# EAGLE design Nappe2.0 _ Pannelized_3 (EAGLE 9.6.2)
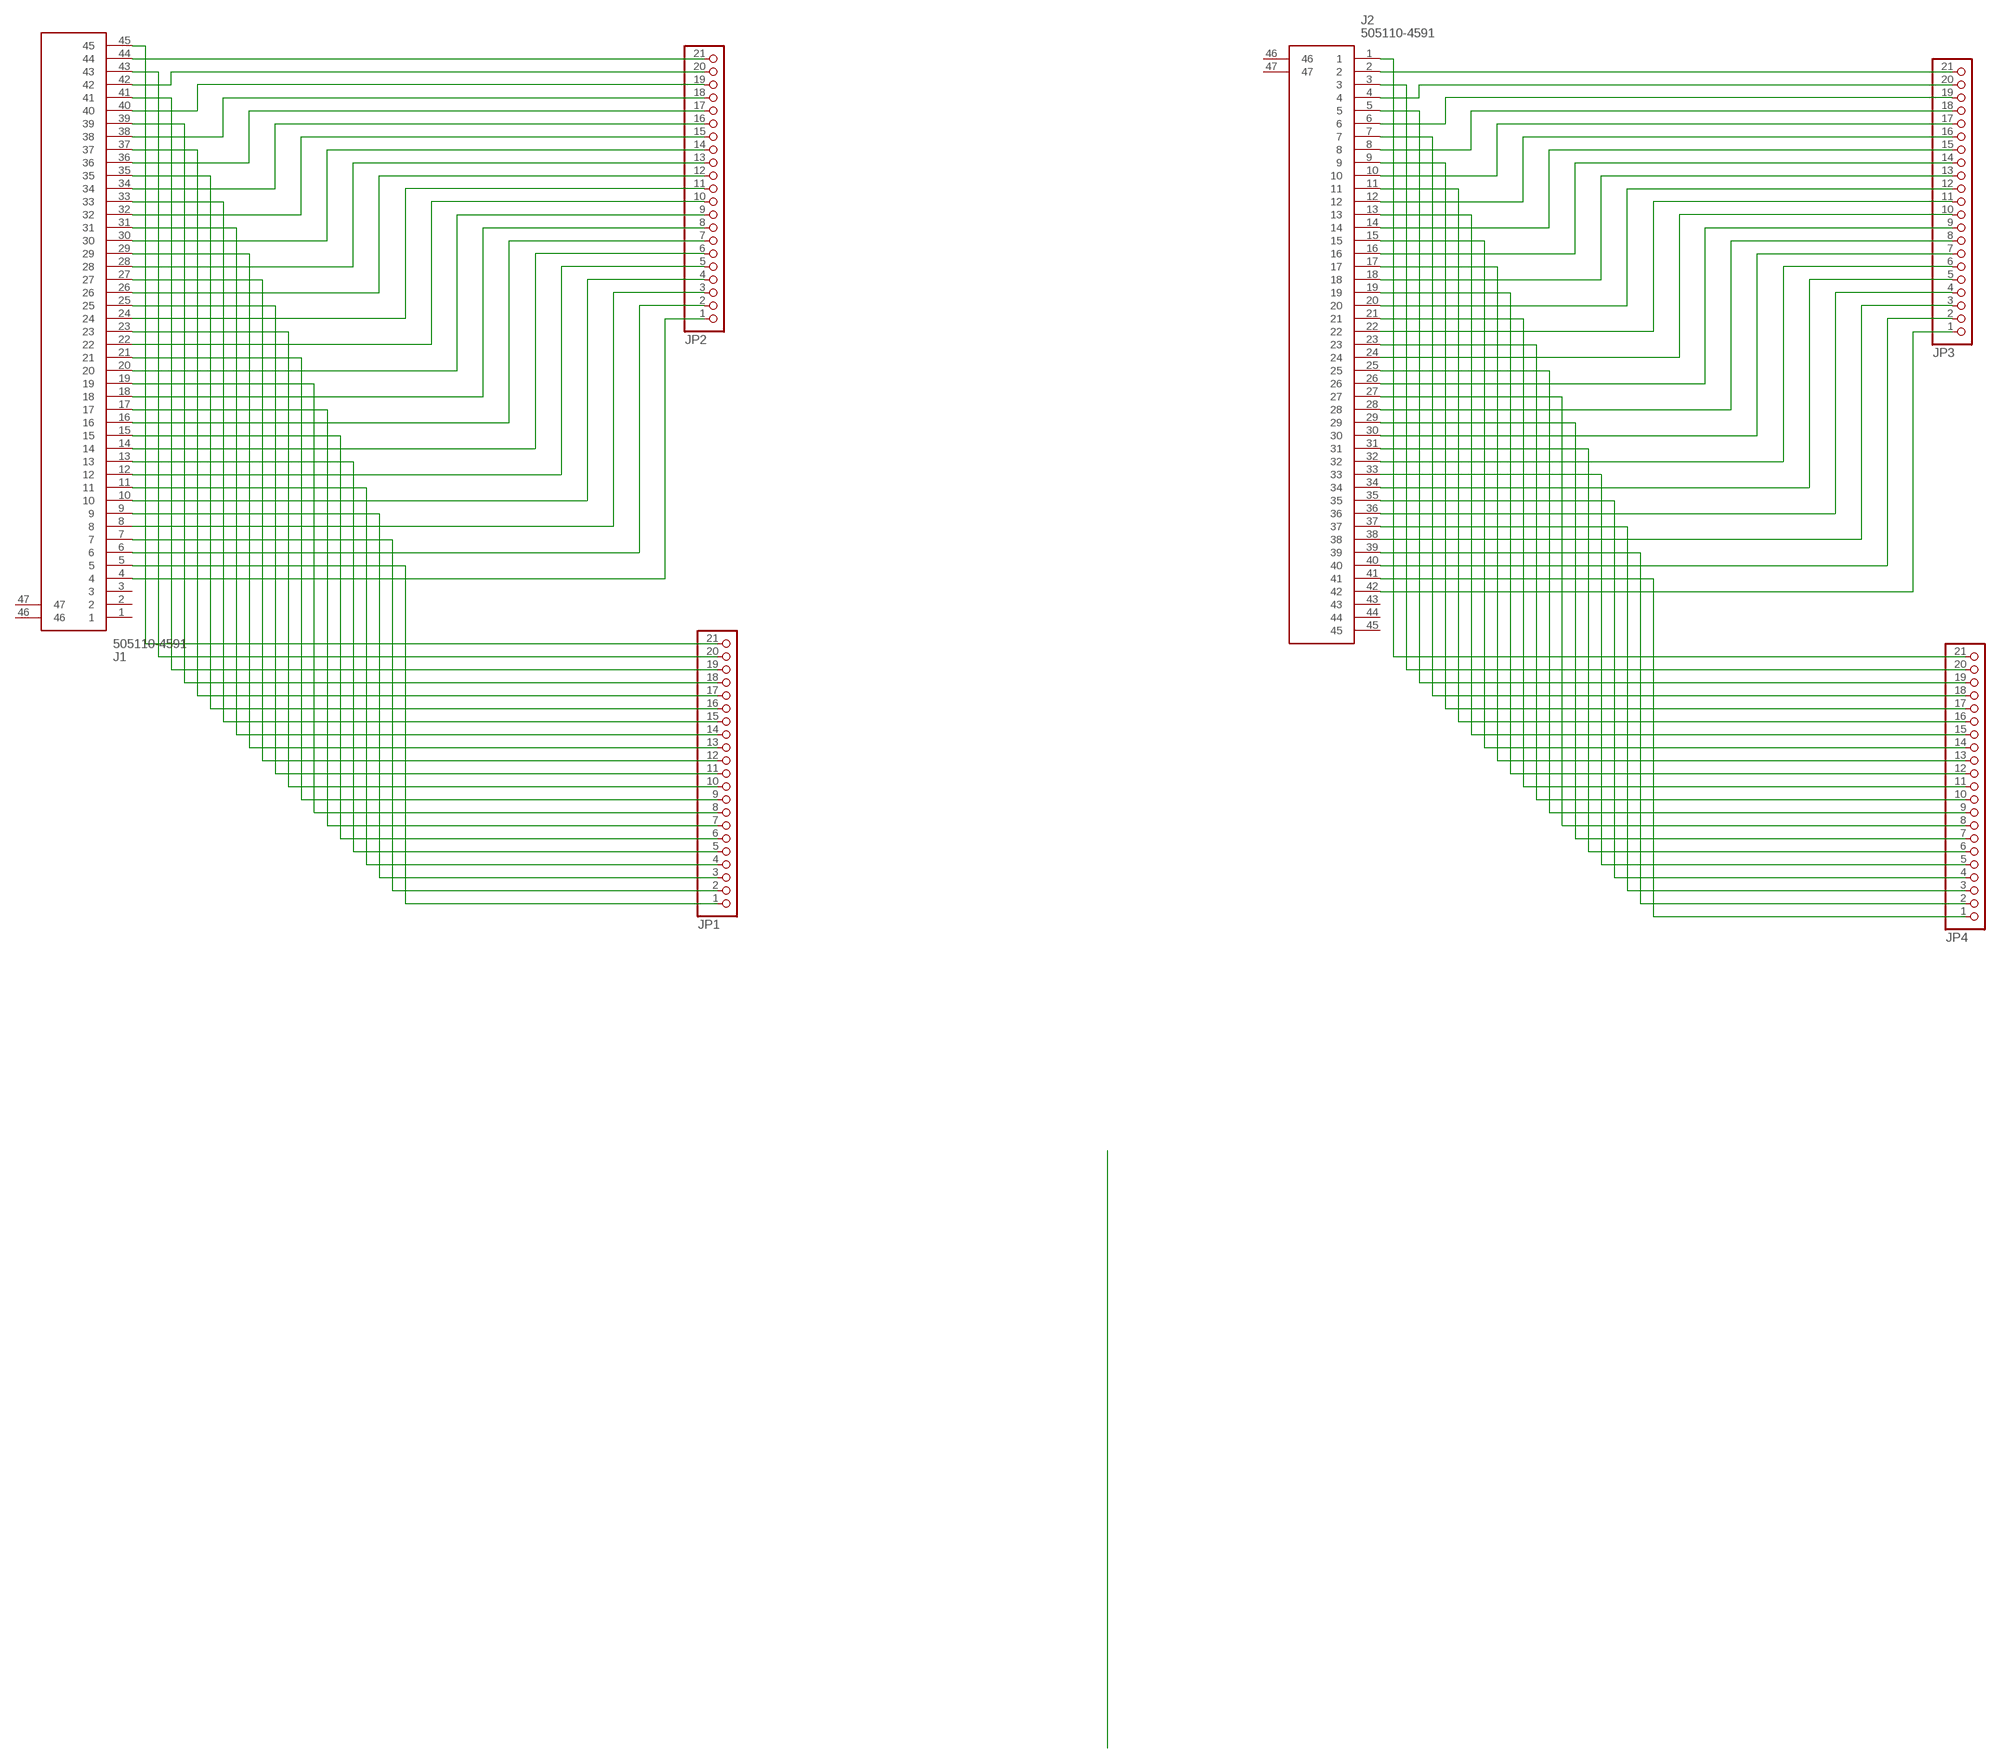
[diagram p0: schematic, sheet 1]

## Parts
J1  505110-4591  [5051104591]
J2  505110-4591  [5051104591]
JP1  PINHD-1X21(2.4)  [1X21(2.4)]
JP2  PINHD-1X21(2.4)  [1X21(2.4)]
JP3  PINHD-1X21(2.4)  [1X21(2.4)]
JP4  PINHD-1X21(2.4)  [1X21(2.4)]

## Nets
N$1: J2.2 JP3.21
N$6: J2.3 JP4.20
N$9: J2.26 JP3.9
N$10: J2.4 JP3.20
N$13: J2.6 JP3.19
N$14: J2.28 JP3.8
N$15: J2.18 JP3.13
N$16: J2.8 JP3.18
N$17: J2.10 JP3.17
N$19: J2.12 JP3.16
N$22: J2.14 JP3.15
N$23: J2.16 JP3.14
N$24: J2.20 JP3.12
N$25: J2.22 JP3.11
N$26: J2.24 JP3.10
N$27: J2.30 JP3.7
N$28: J2.32 JP3.6
N$29: J2.34 JP3.5
N$30: J2.36 JP3.4
N$31: J2.42 JP3.1
N$32: J2.40 JP3.2
N$33: J2.38 JP3.3
N$34: J2.1 JP4.21
N$35: J2.5 JP4.19
N$36: J2.7 JP4.18
N$37: J2.9 JP4.17
N$38: J2.11 JP4.16
N$39: J2.13 JP4.15
N$40: J2.15 JP4.14
N$41: J2.17 JP4.13
N$42: J2.41 JP4.1
N$43: J1.44 JP2.21
N$44: J1.42 JP2.20
N$45: J1.40 JP2.19
N$46: J2.27 JP4.8
N$47: J1.38 JP2.18
N$48: J1.36 JP2.17
N$49: J2.33 JP4.5
N$50: J1.34 JP2.16
N$51: J1.32 JP2.15
N$52: J2.21 JP4.11
N$53: J2.23 JP4.10
N$54: J2.25 JP4.9
N$55: J1.30 JP2.14
N$56: J2.29 JP4.7
N$57: J2.31 JP4.6
N$59: J2.39 JP4.2
N$60: J2.37 JP4.3
N$61: J2.35 JP4.4
N$62: J2.19 JP4.12
N$63: J1.28 JP2.13
N$64: J1.26 JP2.12
N$65: J1.24 JP2.11
N$66: J1.22 JP2.10
N$67: J1.20 JP2.9
N$68: J1.18 JP2.8
N$69: J1.16 JP2.7
N$70: J1.14 JP2.6
N$71: J1.12 JP2.5
N$72: J1.10 JP2.4
N$73: J1.6 JP2.2
N$74: J1.8 JP2.3
N$75: J1.4 JP2.1
N$77: J1.45 JP1.21
N$78: J1.43 JP1.20
N$79: J1.41 JP1.19
N$80: J1.39 JP1.18
N$81: J1.37 JP1.17
N$82: J1.35 JP1.16
N$83: J1.33 JP1.15
N$84: J1.31 JP1.14
N$85: J1.29 JP1.13
N$86: J1.19 JP1.8
N$88: J1.25 JP1.11
N$89: J1.23 JP1.10
N$90: J1.21 JP1.9
N$91: J1.17 JP1.7
N$92: J1.15 JP1.6
N$93: J1.13 JP1.5
N$96: J1.7 JP1.2
N$98: J1.9 JP1.3
N$99: J1.11 JP1.4
N$100: J1.27 JP1.12
N$101: J1.5 JP1.1
Unconnected: J1.1 J1.2 J1.3 J1.46 J1.47 J2.43 J2.44 J2.45 J2.46 J2.47

## Library data of the parts
J1 J2 = Molex - 505110-4591:505110-4591: MOLEX - 505110-4591 - CONNECTOR, FFC/FPC, 45POS, 1ROW, 0.5MM Source: Datasheet <https://www.molex.com/pdm_docs/sd/5051104591_sd.pdf>; DESCRIPTION: MOLEX - 505110-4591 - CONNECTOR, FFC/FPC, 45POS, 1ROW, 0.5MM; HEIGHT: 2.1mm; MANUFACTURER_NAME: Molex; MANUFACTURER_PART_NUMBER: 505110-4591; MOUSER_PART_NUMBER: 538-505110-4591; MOUSER_PRICE-STOCK: https://www.mouser.co.uk/ProductDetail/Molex/505110-4591?qs=fSIr1QPo%2F%2FReZXIaVbuxKA%3D%3D
JP1-JP4 = pinhead:PINHD-1X21(2.4): PIN HEADER

## Board
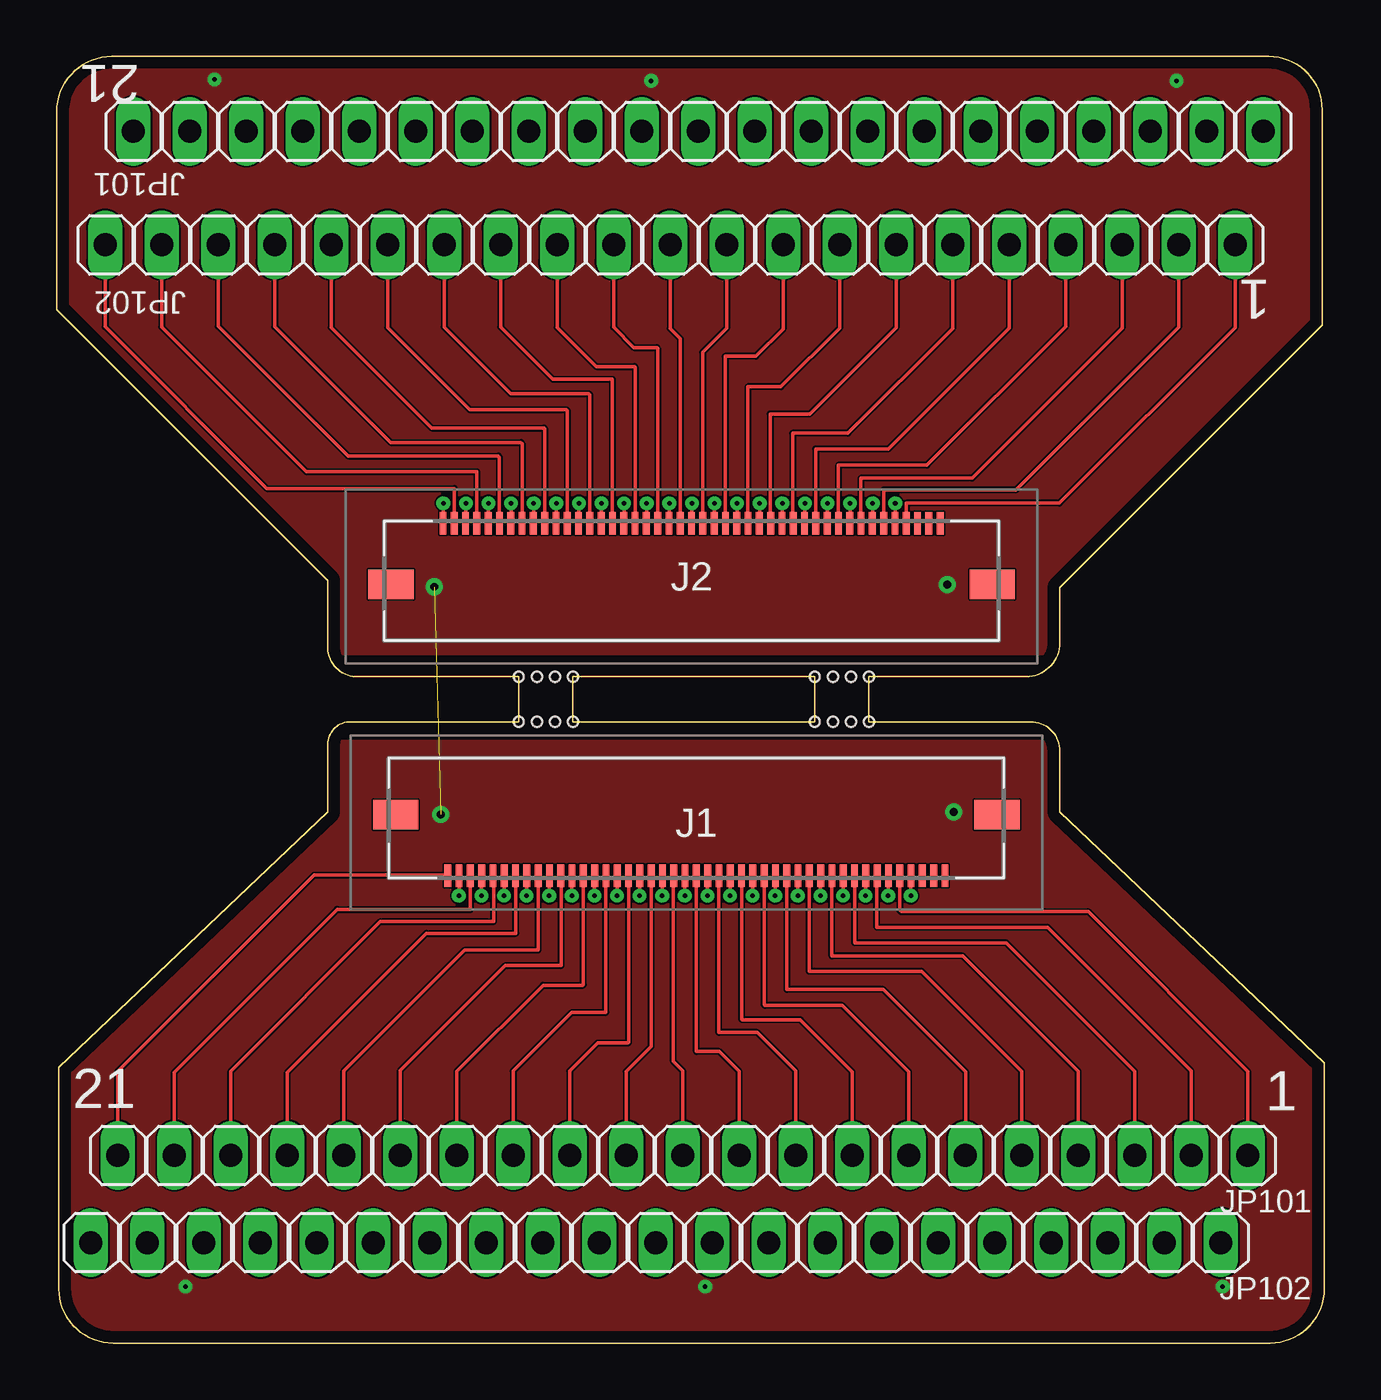
[diagram p1: board, top side]
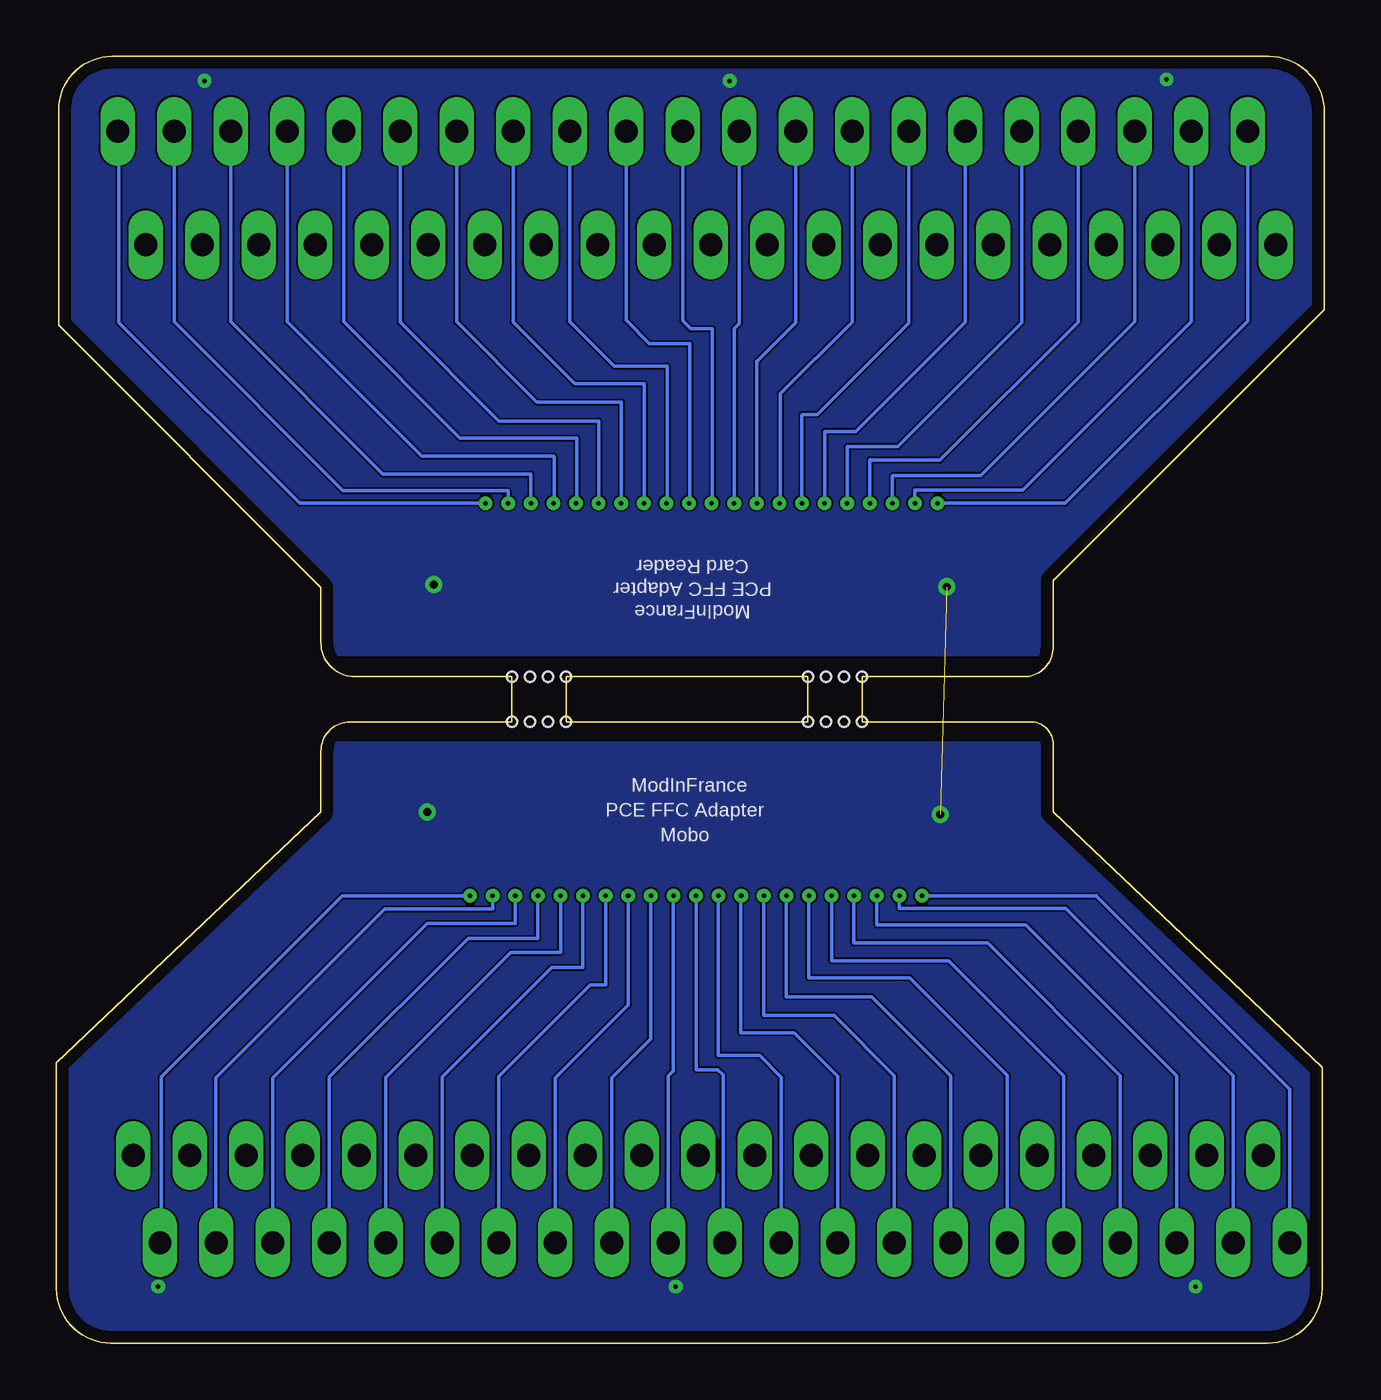
[diagram p2: board, bottom side, seen from below]

Size 56.1 x 56.95 mm. Coordinates in mm from the lower left corner, seen from the top.
Outline: 2.5,0 53.7,0 arc90 56.1,2.4 56.1,12.4 44.4,23.5 44.4,26.2 arc90 43.1,27.5 35.95,27.5 35.95,29.5 42.9,29.5 arc90 44.4,31 44.4,33.45 56,45.05 56,54.6 arc90 53.65,56.95 2.45,56.95 arc90 0,54.5 0,45.75 12,33.75 12,30.75 arc90 13.35,29.5 20.45,29.5 20.45,27.5 13,27.5 arc90 12,26.5 12,23.5 0.1,12.2 0.1,2.4 arc90 2.5,0
Outline: 22.85,29.5 22.85,27.5 33.55,27.5 33.55,29.5 22.85,29.5
Copper layers (1*16): Top 0.035mm / dielectric 1.5mm / Bottom 0.035mm
Design rules "default *": minimum track width 3mil, minimum drill 0.2mm, track to track 3mil, track to pad 3mil, pad to pad 3mil, via to via 3mil, smd to smd 3mil, copper to edge 20mil, drill to drill 3mil, minimum pad ring 10mil, minimum via ring 8mil, stop-mask expansion 4mil, vias tented up to drill 0mil, thermal gap 10mil
Holes 0.45 mm at 20.45,29.5 21.25,29.5 22.05,29.5 22.85,29.5 20.45,27.5 21.25,27.5 22.05,27.5 22.85,27.5 33.55,27.5 34.35,27.5 35.15,27.5 35.95,27.5 33.55,29.5 34.35,29.5 35.15,29.5 35.95,29.5
tRestrict: area 11.4,26.8 to 45.1,30.4
bRestrict: area 11.4,26.7 to 45.1,30.3

### Footprints (pad centres in the part's own frame; a part is rotated, then mirrored left to right if it is on the bottom)
5051104591 = smd 0.3 x 1: 1 -11,2.35; 2 -10.5,2.35; 3 -10,2.35; 4 -9.5,2.35; 5 -9,2.35; 6 -8.5,2.35; 7 -8,2.35; 8 -7.5,2.35; 9 -7,2.35; 10 -6.5,2.35; 11 -6,2.35; 12 -5.5,2.35; 13 -5,2.35; 14 -4.5,2.35; 15 -4,2.35; 16 -3.5,2.35; 17 -3,2.35; 18 -2.5,2.35; 19 -2,2.35; 20 -1.5,2.35; 21 -1,2.35; 22 -0.5,2.35; 23 0,2.35; 24 0.5,2.35; 25 1,2.35; 26 1.5,2.35; 27 2,2.35; 28 2.5,2.35; 29 3,2.35; 30 3.5,2.35; 31 4,2.35; 32 4.5,2.35; 33 5,2.35; 34 5.5,2.35; 35 6,2.35; 36 6.5,2.35; 37 7,2.35; 38 7.5,2.35; 39 8,2.35; 40 8.5,2.35; 41 9,2.35; 42 9.5,2.35; 43 10,2.35; 44 10.5,2.35; 45 11,2.35 | smd 2 x 1.3: 46 -13.3,-0.35; 47 13.3,-0.35
1X21(2.4) = drill 1.016 long: 1 -23.99,0; 2 -21.49,0; 3 -18.99,0; 4 -16.49,0; 5 -13.99,0; 6 -11.49,0; 7 -8.99,0; 8 -6.49,0; 9 -3.99,0; 10 -1.49,0; 11 1.01,0; 12 3.51,0; 13 6.01,0; 14 8.51,0; 15 11.01,0; 16 13.51,0; 17 16.01,0; 18 18.51,0; 19 21.01,0; 20 23.51,0; 21 26.01,0

### Placement (x,y rotation side)
J1  28.31,23.04 180 top
J2  28.1,33.94 0 top
JP1  28.72,8.3 180 top
JP2  27.53,4.44 180 top
JP3  28.16,48.61 180 top
JP4  29.41,53.63 180 top

### Tracks (layer width: path | path; a pad name or v marks a point on that pad's centre or on a via)
GND  (via drill 0.2, 0.35)  (1 unrouted)
  other vias: 17,23.4 39.7,23.5 51.6,2.5 28.7,2.5 5.7,2.5 6.98,55.93 49.55,55.87 39.41,33.57 16.71,33.47 26.31,55.87
  pour Bottom: -2.56,64.39 -2.56,-2.02 63.55,-2.02 63.55,64.42 -2.56,64.42 -2.56,64.42
  pour Top: -2.55,64.43 -2.55,-3.51 63.85,-3.51 63.85,64.43 -2.55,64.43
N$1
  Top 0.152: JP3.21 2.15,44.98 9.3,37.83 17.6,37.83 J2.2
N$6  (via drill 0.2)
  Top 0.152: v18.11,37.17 18.11,36.3 J2.3
  Bottom 0.152: JP4.20 5.9,45.22 13.35,37.76 18.1,37.76 18.11,37.75 v18.11,37.17
N$9
  Top 0.152: JP3.9 32.15,44.89 30.95,43.69 29.58,43.69 29.58,36.31 J2.26
N$10
  Top 0.152: JP3.20 4.65,44.97 11.05,38.57 18.59,38.57 18.6,38.56 J2.4
N$13
  Top 0.152: JP3.19 7.15,45.01 12.9,39.27 19.55,39.27 19.6,39.22 J2.6
N$14
  Top 0.152: JP3.8 34.65,44.93 32.05,42.33 30.59,42.33 30.59,36.3 J2.28
N$15
  Top 0.152: JP3.13 22.15,44.95 23.88,43.23 25.58,43.23 25.6,43.2 J2.18
N$16
  Top 0.152: JP3.18 9.65,44.98 14.78,39.86 20.54,39.86 20.6,39.81 J2.8
N$17
  Top 0.152: JP3.17 12.15,44.95 16.6,40.51 21.57,40.51 21.6,40.48 J2.10
N$19
  Top 0.152: JP3.16 14.65,44.95 18.29,41.31 22.55,41.31 22.6,41.27 J2.12
N$22
  Top 0.152: JP3.15 17.15,44.97 20.1,42.02 23.55,42.02 23.6,41.97 J2.14
N$23
  Top 0.152: JP3.14 19.65,44.98 21.96,42.67 24.6,42.67 J2.16
N$24
  Top 0.152: JP3.12 24.65,44.96 25.54,44.07 26.57,44.07 26.6,44.04 J2.20
N$25
  Top 0.152: JP3.11 27.15,44.91 27.6,44.46 J2.22
N$26
  Top 0.152: JP3.10 29.65,44.92 28.59,43.85 28.59,36.3 J2.24
N$27
  Top 0.152: JP3.7 37.15,44.95 33.33,41.13 31.57,41.13 31.57,36.32 J2.30
N$28
  Top 0.152: JP3.6 39.65,44.91 35.02,40.27 32.57,40.27 32.57,36.31 J2.32
N$29
  Top 0.152: JP3.5 42.15,44.92 36.81,39.58 33.59,39.58 33.59,36.3 J2.34
N$30
  Top 0.152: JP3.4 44.65,45 38.52,38.86 34.59,38.86 J2.36
N$31
  Top 0.152: JP3.1 52.15,44.95 44.37,37.17 37.6,37.17 J2.42
N$32
  Top 0.152: JP3.2 49.65,44.97 42.45,37.77 36.6,37.77 J2.40
N$33
  Top 0.152: JP3.3 47.15,44.93 40.51,38.29 35.59,38.29 35.59,36.3 J2.38
N$34  (via drill 0.2)
  Top 0.152: v17.11,37.17 17.11,36.3 J2.1
  Bottom 0.152: JP4.21 3.4,45.23 11.45,37.17 v17.11,37.17
N$35  (via drill 0.2)
  Top 0.152: v19.11,37.17 19.11,36.3 J2.5
  Bottom 0.152: JP4.19 8.4,45.21 15.21,38.4 19.1,38.4 19.11,38.38 v19.11,37.17
N$36  (via drill 0.2)
  Top 0.152: v20.11,37.17 20.11,36.3 J2.7
  Bottom 0.152: JP4.18 10.9,45.19 17.01,39.07 20.06,39.07 20.09,39.11 20.11,39.09 v20.11,37.17
N$37  (via drill 0.2)
  Top 0.152: v21.11,37.17 21.11,36.3 J2.9
  Bottom 0.152: JP4.17 13.4,45.16 18.88,39.68 21.12,39.68 v21.12,37.18 v21.11,37.17
N$38  (via drill 0.2)
  Top 0.152: v22.11,37.17 22.11,36.3 J2.11
  Bottom 0.152: JP4.16 15.9,45.18 20.73,40.35 22.11,40.35 v22.11,37.17
N$39  (via drill 0.2)
  Top 0.152: v23.11,37.17 23.11,36.3 J2.13
  Bottom 0.152: JP4.15 18.4,45.14 22.43,41.11 23.09,41.11 23.11,41.08 v23.11,37.17
N$40  (via drill 0.2)
  Top 0.152: v24.11,37.17 24.11,36.3 J2.15
  Bottom 0.152: JP4.14 20.9,45.2 24.08,42.02 24.08,37.21 v24.11,37.17
N$41  (via drill 0.2)
  Top 0.152: v25.11,37.17 25.11,36.3 J2.17
  Bottom 0.152: JP4.13 23.4,45.17 25.08,43.49 25.11,43.46 v25.11,37.17
N$42  (via drill 0.2)
  Top 0.152: v37.11,37.17 37.11,36.3 J2.41
  Bottom 0.152: v37.11,37.17 45.35,37.17 53.35,45.18 53.35,53.59 JP4.1
N$43  (via drill 0.2)
  Top 0.152: J1.44 v17.81,19.8 v17.8,19.8
  Bottom 0.152: JP2.21 1.52,11.23 9.95,19.66 10.09,19.8 | 10.09,19.8 10.1,19.81 | v17.8,19.8 10.09,19.8
N$44  (via drill 0.2)
  Top 0.152: v18.8,19.8 18.8,20.68 J1.42
  Bottom 0.152: JP2.20 4.02,11.82 11.44,19.24 18.8,19.24 v18.8,19.8
N$45  (via drill 0.2)
  Top 0.152: v19.8,19.8 19.8,20.68 J1.40
  Bottom 0.152: JP2.19 6.52,11.82 13.2,18.5 19.79,18.5 19.8,18.52 v19.8,19.8
N$46  (via drill 0.2)
  Top 0.152: v30.11,37.17 30.11,36.3 J2.27
  Bottom 0.152: JP4.8 35.9,45.2 33.17,42.47 30.1,42.47 30.1,37.19 v30.11,37.17
N$47  (via drill 0.2)
  Top 0.152: v20.8,19.8 20.8,20.68 J1.38
  Bottom 0.152: JP2.18 9.02,11.83 14.9,17.71 20.82,17.71 20.82,19.78 v20.8,19.8
N$48  (via drill 0.2)
  Top 0.152: v21.8,19.8 21.8,20.68 J1.36
  Bottom 0.152: JP2.17 11.52,11.82 16.62,16.92 21.78,16.92 21.8,16.93 v21.8,19.8
N$49  (via drill 0.2)
  Top 0.152: v33.11,37.17 33.11,36.3 J2.33
  Bottom 0.152: JP4.5 43.4,45.2 38.26,40.06 33.09,40.06 33.08,40.06 33.08,37.2 v33.11,37.17
N$50  (via drill 0.2)
  Top 0.152: v22.8,19.8 22.8,20.68 J1.34
  Bottom 0.152: JP2.16 14.02,11.85 18.34,16.17 22.82,16.17 22.82,19.78 v22.8,19.8
N$51  (via drill 0.2)
  Top 0.152: v23.8,19.8 23.8,20.68 J1.32
  Bottom 0.152: JP2.15 16.52,11.83 20.02,15.32 23.81,15.32 v23.81,19.79 v23.8,19.8
N$52  (via drill 0.2)
  Top 0.152: v27.11,37.17 27.11,36.3 J2.21
  Bottom 0.152: JP4.11 28.4,45.25 28.04,44.89 27.08,44.89 27.08,37.21 v27.11,37.17
N$53  (via drill 0.2)
  Top 0.152: v28.11,37.17 28.11,36.3 J2.23
  Bottom 0.152: JP4.10 30.9,45.27 29.87,44.25 28.09,44.25 28.09,37.2 v28.11,37.17
N$54  (via drill 0.2)
  Top 0.152: v29.11,37.17 29.11,36.3 J2.25
  Bottom 0.152: JP4.9 33.4,45.22 31.42,43.25 29.09,43.25 29.08,43.25 29.08,37.2 v29.11,37.17
N$55  (via drill 0.2)
  Top 0.152: v24.8,19.8 24.8,20.68 J1.30
  Bottom 0.152: JP2.14 19.02,11.83 21.69,14.5 24.8,14.5 v24.8,19.8 | v24.8,19.8
N$56  (via drill 0.2)
  Top 0.152: v31.11,37.17 31.11,36.3 J2.29
  Bottom 0.152: JP4.7 38.4,45.21 34.84,41.66 31.1,41.66 31.1,37.18 v31.11,37.17
N$57  (via drill 0.2)
  Top 0.152: v32.11,37.17 32.11,36.3 J2.31
  Bottom 0.152: JP4.6 40.9,45.18 36.52,40.81 32.12,40.81 32.11,40.81 v32.11,37.17
N$59  (via drill 0.2)
  Top 0.152: v36.11,37.17 36.11,36.3 J2.39
  Bottom 0.152: JP4.2 50.9,45.2 43.42,37.73 36.11,37.73 v36.11,37.18 v36.11,37.17
N$60  (via drill 0.2)
  Top 0.152: v35.11,37.17 35.11,36.3 J2.37
  Bottom 0.152: JP4.3 48.4,45.21 41.66,38.47 35.11,38.47 v35.11,37.18 v35.11,37.17
N$61  (via drill 0.2)
  Top 0.152: v34.11,37.17 34.11,36.3 J2.35
  Bottom 0.152: JP4.4 45.9,45.21 39.95,39.26 34.1,39.26 34.08,39.25 34.08,37.2 v34.11,37.17
N$62  (via drill 0.2)
  Top 0.152: v26.11,37.17 26.11,36.3 J2.19
  Bottom 0.152: JP4.12 25.9,45.11 26.11,44.9 v26.11,37.17
N$63  (via drill 0.2)
  Top 0.152: v25.8,19.8 25.8,20.68 J1.28
  Bottom 0.152: JP2.13 21.52,11.8 23.46,13.74 25.81,13.74 25.81,19.79 v25.8,19.8
N$64  (via drill 0.2)
  Top 0.152: v26.8,19.8 26.8,20.68 J1.26
  Bottom 0.152: JP2.12 24.02,11.76 24.99,12.73 26.81,12.73 v26.81,19.79 v26.8,19.8
N$65  (via drill 0.2)
  Top 0.152: v27.8,19.8 27.8,20.68 J1.24
  Bottom 0.152: JP2.11 26.6,4.52 26.6,11.86 26.83,12.1 27.79,12.1 27.8,12.11 v27.8,19.8
N$66  (via drill 0.2)
  Top 0.152: v28.8,19.8 28.8,20.68 J1.22
  Bottom 0.152: JP2.10 29.02,11.82 28.8,12.04 v28.8,19.8
N$67  (via drill 0.2)
  Top 0.152: v29.8,19.8 29.8,20.68 J1.20
  Bottom 0.152: JP2.9 31.54,4.46 31.54,11.73 29.8,13.47 v29.8,19.8
N$68  (via drill 0.2)
  Top 0.152: v30.8,19.8 30.8,20.68 J1.18
  Bottom 0.152: JP2.8 34.02,11.75 30.8,14.97 v30.8,19.8
N$69  (via drill 0.2)
  Top 0.152: v31.8,19.8 31.8,20.68 J1.16
  Bottom 0.152: JP2.7 36.52,11.81 32.48,15.85 31.8,15.85 v31.8,19.8
N$70  (via drill 0.2)
  Top 0.152: v32.8,19.8 32.8,20.68 J1.14
  Bottom 0.152: JP2.6 39.02,11.78 34.18,16.63 32.82,16.63 32.82,19.78 | 32.82,19.78 32.82,19.81 | v32.8,19.8 32.82,19.78
N$71  (via drill 0.2)
  Top 0.152: v33.8,19.8 33.8,20.68 J1.12
  Bottom 0.152: JP2.5 41.52,11.77 36,17.29 33.79,17.29 v33.79,19.79 v33.8,19.8
N$72  (via drill 0.2)
  Top 0.152: v34.8,19.8 34.8,20.68 J1.10
  Bottom 0.152: JP2.4 44.02,11.77 37.89,17.91 34.8,17.91 v34.8,19.8
N$73  (via drill 0.2)
  Top 0.152: v36.8,19.8 36.8,20.68 J1.6
  Bottom 0.152: JP2.2 49.05,4.48 49.05,11.75 41.58,19.21 36.8,19.21 v36.8,19.8 | v36.8,19.8
N$74  (via drill 0.2)
  Top 0.152: v35.8,19.8 35.8,20.68 J1.8
  Bottom 0.152: JP2.3 46.52,11.75 39.68,18.59 35.8,18.59 v35.8,19.8
N$75  (via drill 0.2)
  Top 0.152: v37.8,19.8 37.8,20.68 J1.4
  Bottom 0.152: JP2.1 51.47,4.49 51.47,11.78 43.45,19.8 v37.8,19.8
N$77
  Top 0.152: JP1.21 2.71,12.03 11.39,20.72 17.28,20.72 J1.45
N$78
  Top 0.152: J1.43 18.31,19.2 | 18.31,19.2 18.31,19.19 | JP1.20 5.21,11.99 12.42,19.2 18.31,19.2
N$79
  Top 0.152: JP1.19 7.71,12.03 14.33,18.65 19.34,18.65 19.34,19.84 19.34,20.66 J1.41
N$80
  Top 0.152: JP1.18 10.21,11.97 16.37,18.13 20.32,18.13 20.32,20.68 J1.39
N$81
  Top 0.152: JP1.17 12.71,12.05 18.06,17.4 21.3,17.4 21.31,17.41 J1.37
N$82
  Top 0.152: JP1.16 15.21,12.06 19.86,16.71 22.32,16.71 22.32,20.67 J1.35
N$83
  Top 0.152: JP1.15 17.71,12.03 21.53,15.84 23.29,15.84 23.31,15.86 J1.33
N$84
  Top 0.152: JP1.14 20.2,12.04 22.8,14.64 24.29,14.64 24.31,14.66 J1.31
N$85
  Top 0.152: JP1.13 22.7,12.04 23.94,13.28 25.28,13.28 25.31,13.31 J1.29
N$86
  Top 0.152: JP1.8 35.21,12.01 32.91,14.31 30.34,14.31 30.31,14.34 J1.19
N$88
  Top 0.152: JP1.11 27.71,12.05 27.29,12.47 27.29,20.67 J1.25
N$89
  Top 0.152: JP1.10 30.21,12.02 29.32,12.9 28.31,12.9 J1.23
N$90
  Top 0.152: J1.21 29.3,20.67 29.3,13.76 29.31,13.74 31.01,13.74 32.71,12.05 JP1.9
N$91
  Top 0.152: JP1.7 37.71,12.01 34.78,14.94 31.35,14.94 31.31,14.98 J1.17
N$92
  Top 0.152: JP1.6 40.22,8.32 40.22,12.01 36.59,15.65 32.31,15.65 J1.15
N$93
  Top 0.152: JP1.5 42.71,12.03 38.28,16.46 33.3,16.46 33.3,20.68 J1.13
N$96
  Top 0.152: JP1.2 50.21,12.05 43.85,18.4 36.3,18.4 36.3,20.68 J1.7
N$98
  Top 0.152: JP1.3 47.71,12.03 42.02,17.72 35.31,17.72 J1.9
N$99
  Top 0.152: JP1.4 45.21,12.03 40.11,17.13 34.31,17.13 J1.11
N$100
  Top 0.152: JP1.12 25.2,12.02 26.31,13.13 J1.27
N$101
  Top 0.152: J1.5 37.31,19.16 37.37,19.1 45.64,19.1 52.71,12.04 JP1.1

### Text on the board
tNames: 21 | JP101 | 1 | JP102 | 21 | 1 | JP101 | JP102
bNames: Card Reader | PCE FFC Adapter | ModInFrance | ModInFrance | PCE FFC Adapter | Mobo